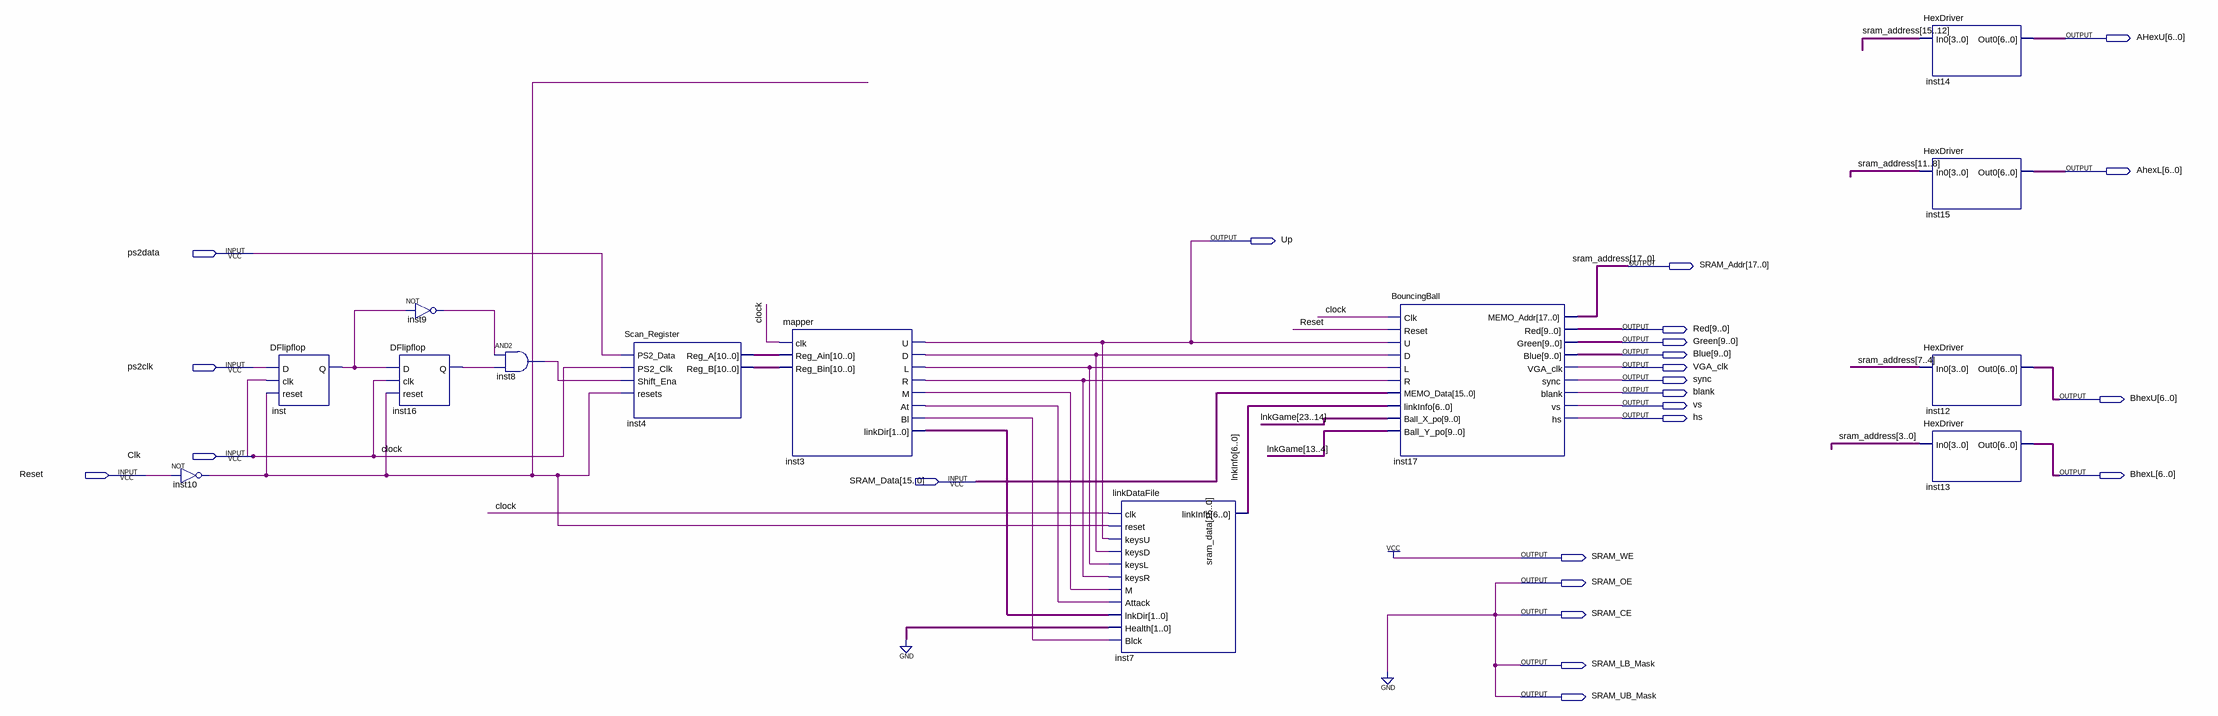
[diagram p0: schematic sheet]
// Quartus schematic Processor.bdf as structural Verilog: 13 symbols, 24 pins
module Processor (
  input  ps2data,
  input  ps2clk,
  input  Clk,
  input  Reset,
  input  [15:0] SRAM_Data,
  output [6:0] AHexU,
  output [6:0] AhexL,
  output Up,
  output [17:0] SRAM_Addr,
  output [9:0] Red,
  output [9:0] Green,
  output [9:0] Blue,
  output VGA_clk,
  output sync,
  output blank,
  output [6:0] BhexU,
  output vs,
  output hs,
  output [6:0] BhexL,
  output SRAM_WE,
  output SRAM_OE,
  output SRAM_CE,
  output SRAM_LB_Mask,
  output SRAM_UB_Mask
);

  wire inst3_at, inst3_bl, inst3_d, inst3_l, inst3_m, inst3_r, inst8_out, inst9_out, inst10_out, inst16_q,
       inst_q;
  wire [1:0] inst3_linkdir;
  wire [6:0] lnkInfo;
  wire [10:0] inst4_reg_a, inst4_reg_b;
  wire [23:4] lnkGame;

  not inst10 (inst10_out, Reset);
  DFlipflop inst (.D(ps2clk), .clk(Clk), .reset(inst10_out), .Q(inst_q));
  not inst9 (inst9_out, inst_q);
  DFlipflop inst16 (.D(inst_q), .clk(Clk), .reset(inst10_out), .Q(inst16_q));
  and inst8 (inst8_out, inst9_out, inst16_q);
  Scan_Register inst4 (
    .PS2_Data(ps2data), .PS2_Clk(Clk), .Shift_Ena(inst8_out), .resets(inst10_out), .Reg_A(inst4_reg_a),
    .Reg_B(inst4_reg_b));
  mapper inst3 (
    .clk(Clk), .Reg_Ain(inst4_reg_a), .Reg_Bin(inst4_reg_b), .U(Up), .D(inst3_d), .L(inst3_l), .R(inst3_r),
    .M(inst3_m), .At(inst3_at), .Bl(inst3_bl), .linkDir(inst3_linkdir));
  linkDataFile inst7 (
    .clk(Clk), .reset(inst10_out), .keysU(Up), .keysD(inst3_d), .keysL(inst3_l), .keysR(inst3_r),
    .M(inst3_m), .Attack(inst3_at), .lnkDir(inst3_linkdir), .Health(2'b00), .Blck(inst3_bl),
    .linkInfo(lnkInfo));
  BouncingBall inst17 (
    .Clk(Clk), .Reset(Reset), .U(Up), .D(inst3_d), .L(inst3_l), .R(inst3_r), .MEMO_Data(SRAM_Data),
    .linkInfo(lnkInfo), .Ball_X_po(lnkGame[23:14]), .Ball_Y_po(lnkGame[13:4]), .MEMO_Addr(SRAM_Addr),
    .Red(Red), .Green(Green), .Blue(Blue), .VGA_clk(VGA_clk), .sync(sync), .blank(blank), .vs(vs), .hs(hs));
  HexDriver inst14 (.In0(SRAM_Addr[15:12]), .Out0(AHexU));
  HexDriver inst15 (.In0(SRAM_Addr[11:8]), .Out0(AhexL));
  HexDriver inst12 (.In0(SRAM_Addr[7:4]), .Out0(BhexU));
  HexDriver inst13 (.In0(SRAM_Addr[3:0]), .Out0(BhexL));

  assign SRAM_CE = 1'b0;
  assign SRAM_LB_Mask = 1'b0;
  assign SRAM_OE = 1'b0;
  assign SRAM_UB_Mask = 1'b0;
  assign SRAM_WE = 1'b1;

  // Other names for the same wires on the sheet: clock = Clk; sram_address[17:0] = SRAM_Addr
endmodule
